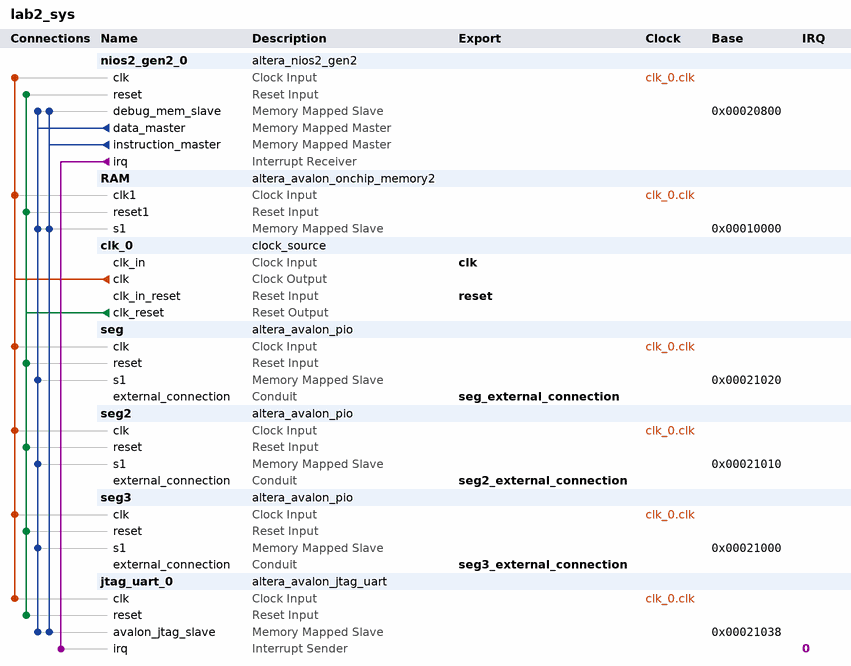
[diagram p0: system contents]
# Platform Designer (Qsys) system lab2_sys, MAX 10 10M50DAF484C7G
# Parameters at their usual value, and those the tool derives, are not listed.
package require -exact qsys 18.1
create_system lab2_sys
set_project_property DEVICE_FAMILY {MAX 10}
set_project_property DEVICE 10M50DAF484C7G

add_instance nios2_gen2_0 altera_nios2_gen2 18.1
set_instance_parameter_value nios2_gen2_0 dcache_size 2048
set_instance_parameter_value nios2_gen2_0 exceptionSlave RAM.s1
set_instance_parameter_value nios2_gen2_0 icache_size 4096
set_instance_parameter_value nios2_gen2_0 impl Tiny
set_instance_parameter_value nios2_gen2_0 resetSlave RAM.s1

add_instance RAM altera_avalon_onchip_memory2 18.1
set_instance_parameter_value RAM dataWidth 32
set_instance_parameter_value RAM dualPort false
set_instance_parameter_value RAM initMemContent false
set_instance_parameter_value RAM initializationFileName onchip_mem.hex
set_instance_parameter_value RAM memorySize 40960

add_instance clk_0 clock_source 18.1
set_instance_parameter_value clk_0 clockFrequency 50000000

add_instance seg altera_avalon_pio 18.1
set_instance_parameter_value seg direction Output
set_instance_parameter_value seg width 8

add_instance seg2 altera_avalon_pio 18.1
set_instance_parameter_value seg2 direction Output
set_instance_parameter_value seg2 width 8

add_instance seg3 altera_avalon_pio 18.1
set_instance_parameter_value seg3 direction Output
set_instance_parameter_value seg3 width 8

add_instance jtag_uart_0 altera_avalon_jtag_uart 18.1
set_instance_parameter_value jtag_uart_0 simInteractiveOptions NO_INTERACTIVE_WINDOWS

# connections
add_connection clk_0.clk jtag_uart_0.clk clock
add_connection clk_0.clk nios2_gen2_0.clk clock
add_connection clk_0.clk RAM.clk1 clock
add_connection clk_0.clk seg2.clk clock
add_connection clk_0.clk seg3.clk clock
add_connection clk_0.clk seg.clk clock
add_connection clk_0.clk_reset jtag_uart_0.reset reset
add_connection clk_0.clk_reset nios2_gen2_0.reset reset
add_connection clk_0.clk_reset RAM.reset1 reset
add_connection clk_0.clk_reset seg2.reset reset
add_connection clk_0.clk_reset seg3.reset reset
add_connection clk_0.clk_reset seg.reset reset
add_connection nios2_gen2_0.data_master jtag_uart_0.avalon_jtag_slave avalon
set_connection_parameter_value nios2_gen2_0.data_master/jtag_uart_0.avalon_jtag_slave baseAddress 0x00021038
add_connection nios2_gen2_0.data_master nios2_gen2_0.debug_mem_slave avalon
set_connection_parameter_value nios2_gen2_0.data_master/nios2_gen2_0.debug_mem_slave baseAddress 0x00020800
add_connection nios2_gen2_0.data_master RAM.s1 avalon
set_connection_parameter_value nios2_gen2_0.data_master/RAM.s1 baseAddress 0x00010000
add_connection nios2_gen2_0.data_master seg2.s1 avalon
set_connection_parameter_value nios2_gen2_0.data_master/seg2.s1 baseAddress 0x00021010
add_connection nios2_gen2_0.data_master seg3.s1 avalon
set_connection_parameter_value nios2_gen2_0.data_master/seg3.s1 baseAddress 0x00021000
add_connection nios2_gen2_0.data_master seg.s1 avalon
set_connection_parameter_value nios2_gen2_0.data_master/seg.s1 baseAddress 0x00021020
add_connection nios2_gen2_0.instruction_master jtag_uart_0.avalon_jtag_slave avalon
set_connection_parameter_value nios2_gen2_0.instruction_master/jtag_uart_0.avalon_jtag_slave baseAddress 0x00021038
add_connection nios2_gen2_0.instruction_master nios2_gen2_0.debug_mem_slave avalon
set_connection_parameter_value nios2_gen2_0.instruction_master/nios2_gen2_0.debug_mem_slave baseAddress 0x00020800
add_connection nios2_gen2_0.instruction_master RAM.s1 avalon
set_connection_parameter_value nios2_gen2_0.instruction_master/RAM.s1 baseAddress 0x00010000
add_connection nios2_gen2_0.irq jtag_uart_0.irq interrupt
set_connection_parameter_value nios2_gen2_0.irq/jtag_uart_0.irq irqNumber 0

# exported interfaces
add_interface clk clock sink
set_interface_property clk EXPORT_OF clk_0.clk_in
add_interface reset reset sink
set_interface_property reset EXPORT_OF clk_0.clk_in_reset
add_interface seg2_external_connection conduit end
set_interface_property seg2_external_connection EXPORT_OF seg2.external_connection
add_interface seg3_external_connection conduit end
set_interface_property seg3_external_connection EXPORT_OF seg3.external_connection
add_interface seg_external_connection conduit end
set_interface_property seg_external_connection EXPORT_OF seg.external_connection

set_interconnect_requirement {$system} qsys_mm.clockCrossingAdapter HANDSHAKE
set_interconnect_requirement {$system} qsys_mm.enableEccProtection FALSE
set_interconnect_requirement {$system} qsys_mm.insertDefaultSlave FALSE
set_interconnect_requirement {$system} qsys_mm.maxAdditionalLatency 1

save_system lab2_sys.qsys
